# EAGLE schematic Schema (EAGLE 6.4)
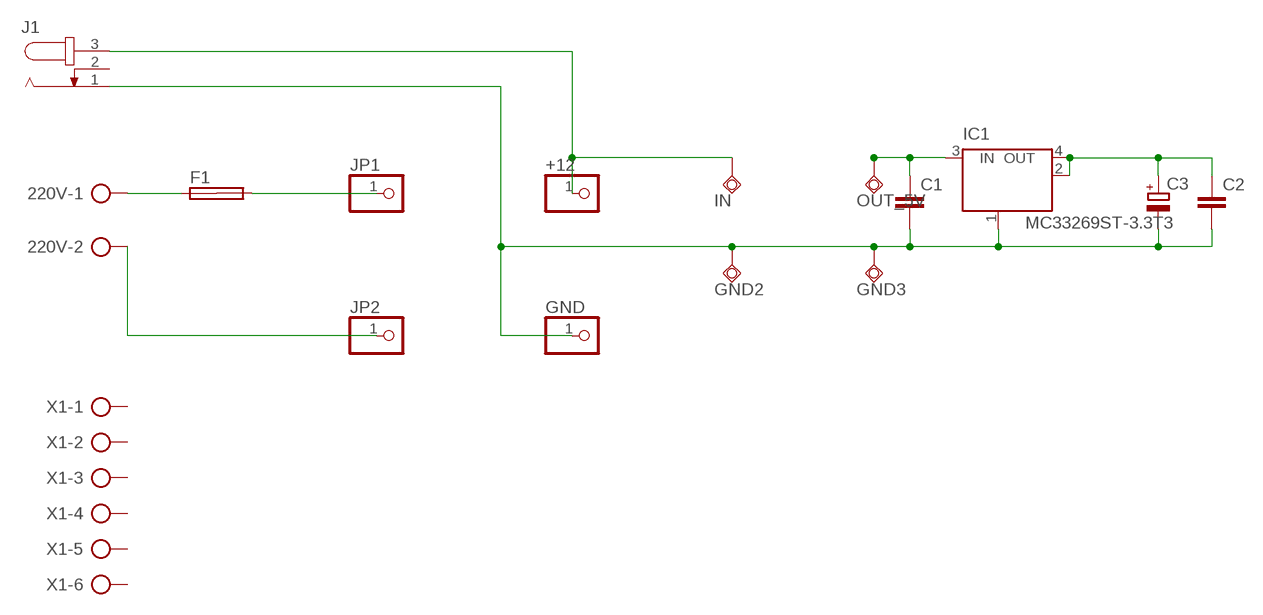
[diagram p0: schematic, sheet 1]

## Parts
220V  AK500/2  [AK500/2]
+12  PINHD-1X1  [1X01]
C1  C-EUC2012  [C2012]
C2  C-EUC2012  [C2012]
C3  CPOL-EUE2.5-5  [E2,5-5]
F1  SH32  [SH32]
GND  PINHD-1X1  [1X01]
GND2  TPSQTP20SQ  [TP20SQ]
GND3  TPSQTP20SQ  [TP20SQ]
IC1  MC33269ST-3.3T3  [SOT223]
IN  TPSQTP20SQ  [TP20SQ]
J1  JACK-PLUG1  [SPC4078]
JP1  PINHD-1X1  [1X01]
JP2  PINHD-1X1  [1X01]
OUT_5V  TPSQTP20SQ  [TP20SQ]
X1  AK500/6  [AK500/6]

## Nets
N$1: 220V.1 F1.1A
N$2: F1.2A JP1.1
N$3: 220V.2 JP2.1
N$4: +12.1 IN.TP J1.3
N$5: C1.2 C2.2 C3.- GND2.TP GND3.TP GND.1 IC1.1(GND/ADJ) J1.1
N$6: C1.1 IC1.3(IN) OUT_5V.TP
N$8: C2.1 C3.+ IC1.2(OUT) IC1.4(OUT)
Unconnected: F1.1B F1.2B J1.2 X1.1 X1.2 X1.3 X1.4 X1.5 X1.6

## Library data of the parts
220V = con-ptr500:AK500/2: CONNECTOR; OC_FARNELL: unknown; OC_NEWARK: unknown
+12 GND JP1 JP2 = pinhead:PINHD-1X1: PIN HEADER
C1 C2 = rcl:C-EU: CAPACITOR, European symbol
C3 = rcl:CPOL-EU: POLARIZED CAPACITOR, European symbol
F1 = fuse:SH32: FUSE HOLDER 6 x 32 mm, SH contact, SHH3N Schukat, 102071 Wickmann (Buerklin); MPN: 10207101009; OC_FARNELL: 811786; OC_NEWARK: 76R6904
GND2 GND3 IN OUT_5V = testpad:TPSQ: Test pad
IC1 = linear:MC33269ST*: Adjustable Output Low Dropout Voltage Regulator 800 mA Source: http://www.onsemi.com/pub/Collateral/MC33269-D.PDF
J1 = con-jack:JACK-PLUG: DC POWER JACK Power Jack, DC, Right Angle, Through Hole, Rated 5A at 16VDC, PC Terminals Distributor: Farnell (www.Farnell.de) Drawing: 84N1161.pdf / 84N1162.pdf Manufacturer: SPC Technology (www.spctechnology.com) Type: SPC4077 / SPC 4078; OC_FARNELL: unknown; OC_NEWARK: unknown
X1 = con-ptr500:AK500/6: CONNECTOR; OC_FARNELL: unknown; OC_NEWARK: unknown